# Altium schematic sheet low-pass-filter.SchDoc
size A4; SheetNumber: 7; SheetTotal: 13
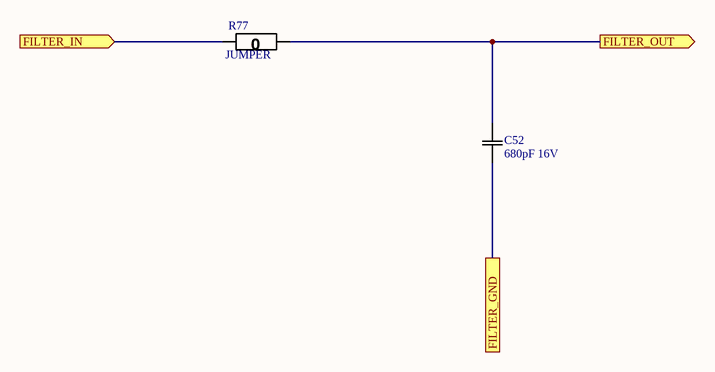
[diagram p0: low-pass-filter.SchDoc]

## Parts
C52  680pF 16V  [0603]
R77  JUMPER  [0603]

## Ports
FILTER_GND, FILTER_IN (in), FILTER_OUT (out)

## Nets
FILTER_GND: C52.1(C1) ; port FILTER_GND
FILTER_IN: R77.2(R2) ; port FILTER_IN
FILTER_OUT: C52.2(C2) R77.1(R1) ; port FILTER_OUT

## Library data of the parts
C52 = CAP 680pF 16V: Default Symbol for Capacitors; Manufacturer Part Number 1: 885012006028; Temperature Coefficient: X5R; Tolerance: 10%; Part Number: CAP 680pF 16V; Value: 680pF; Rating: 16V; Supplier 1: Digi-Key; Supplier Part Number 1: 732-12251-1-ND
R77 = RES 0 JUMPER: RES SMD 0 OHM JUMPER GENERIC 0805; Manufacturer Part Number 1: RK73Z1JTTD; Value: 0; Package: 0805; Part Number: RES 0 JUMPER; Tolerance: N/A; Supplier 1: Digi-Key; Supplier Part Number 1: 2019-RK73Z1JTTDCT-ND; Supplier URL 1: https://www.digikey.ca/en/products/detail/koa-speer-electronics-inc/RK73Z1JTTD/9845478